# EasyEDA schematic SCH_Sensor Gantry PCB_2022-08-15.json
TITLE: Sheet_1; REV: 1.0; Date: 2022-06-12; Sheet: 1/1; Drawn By: Edward Niedziejko; Company: Your Company
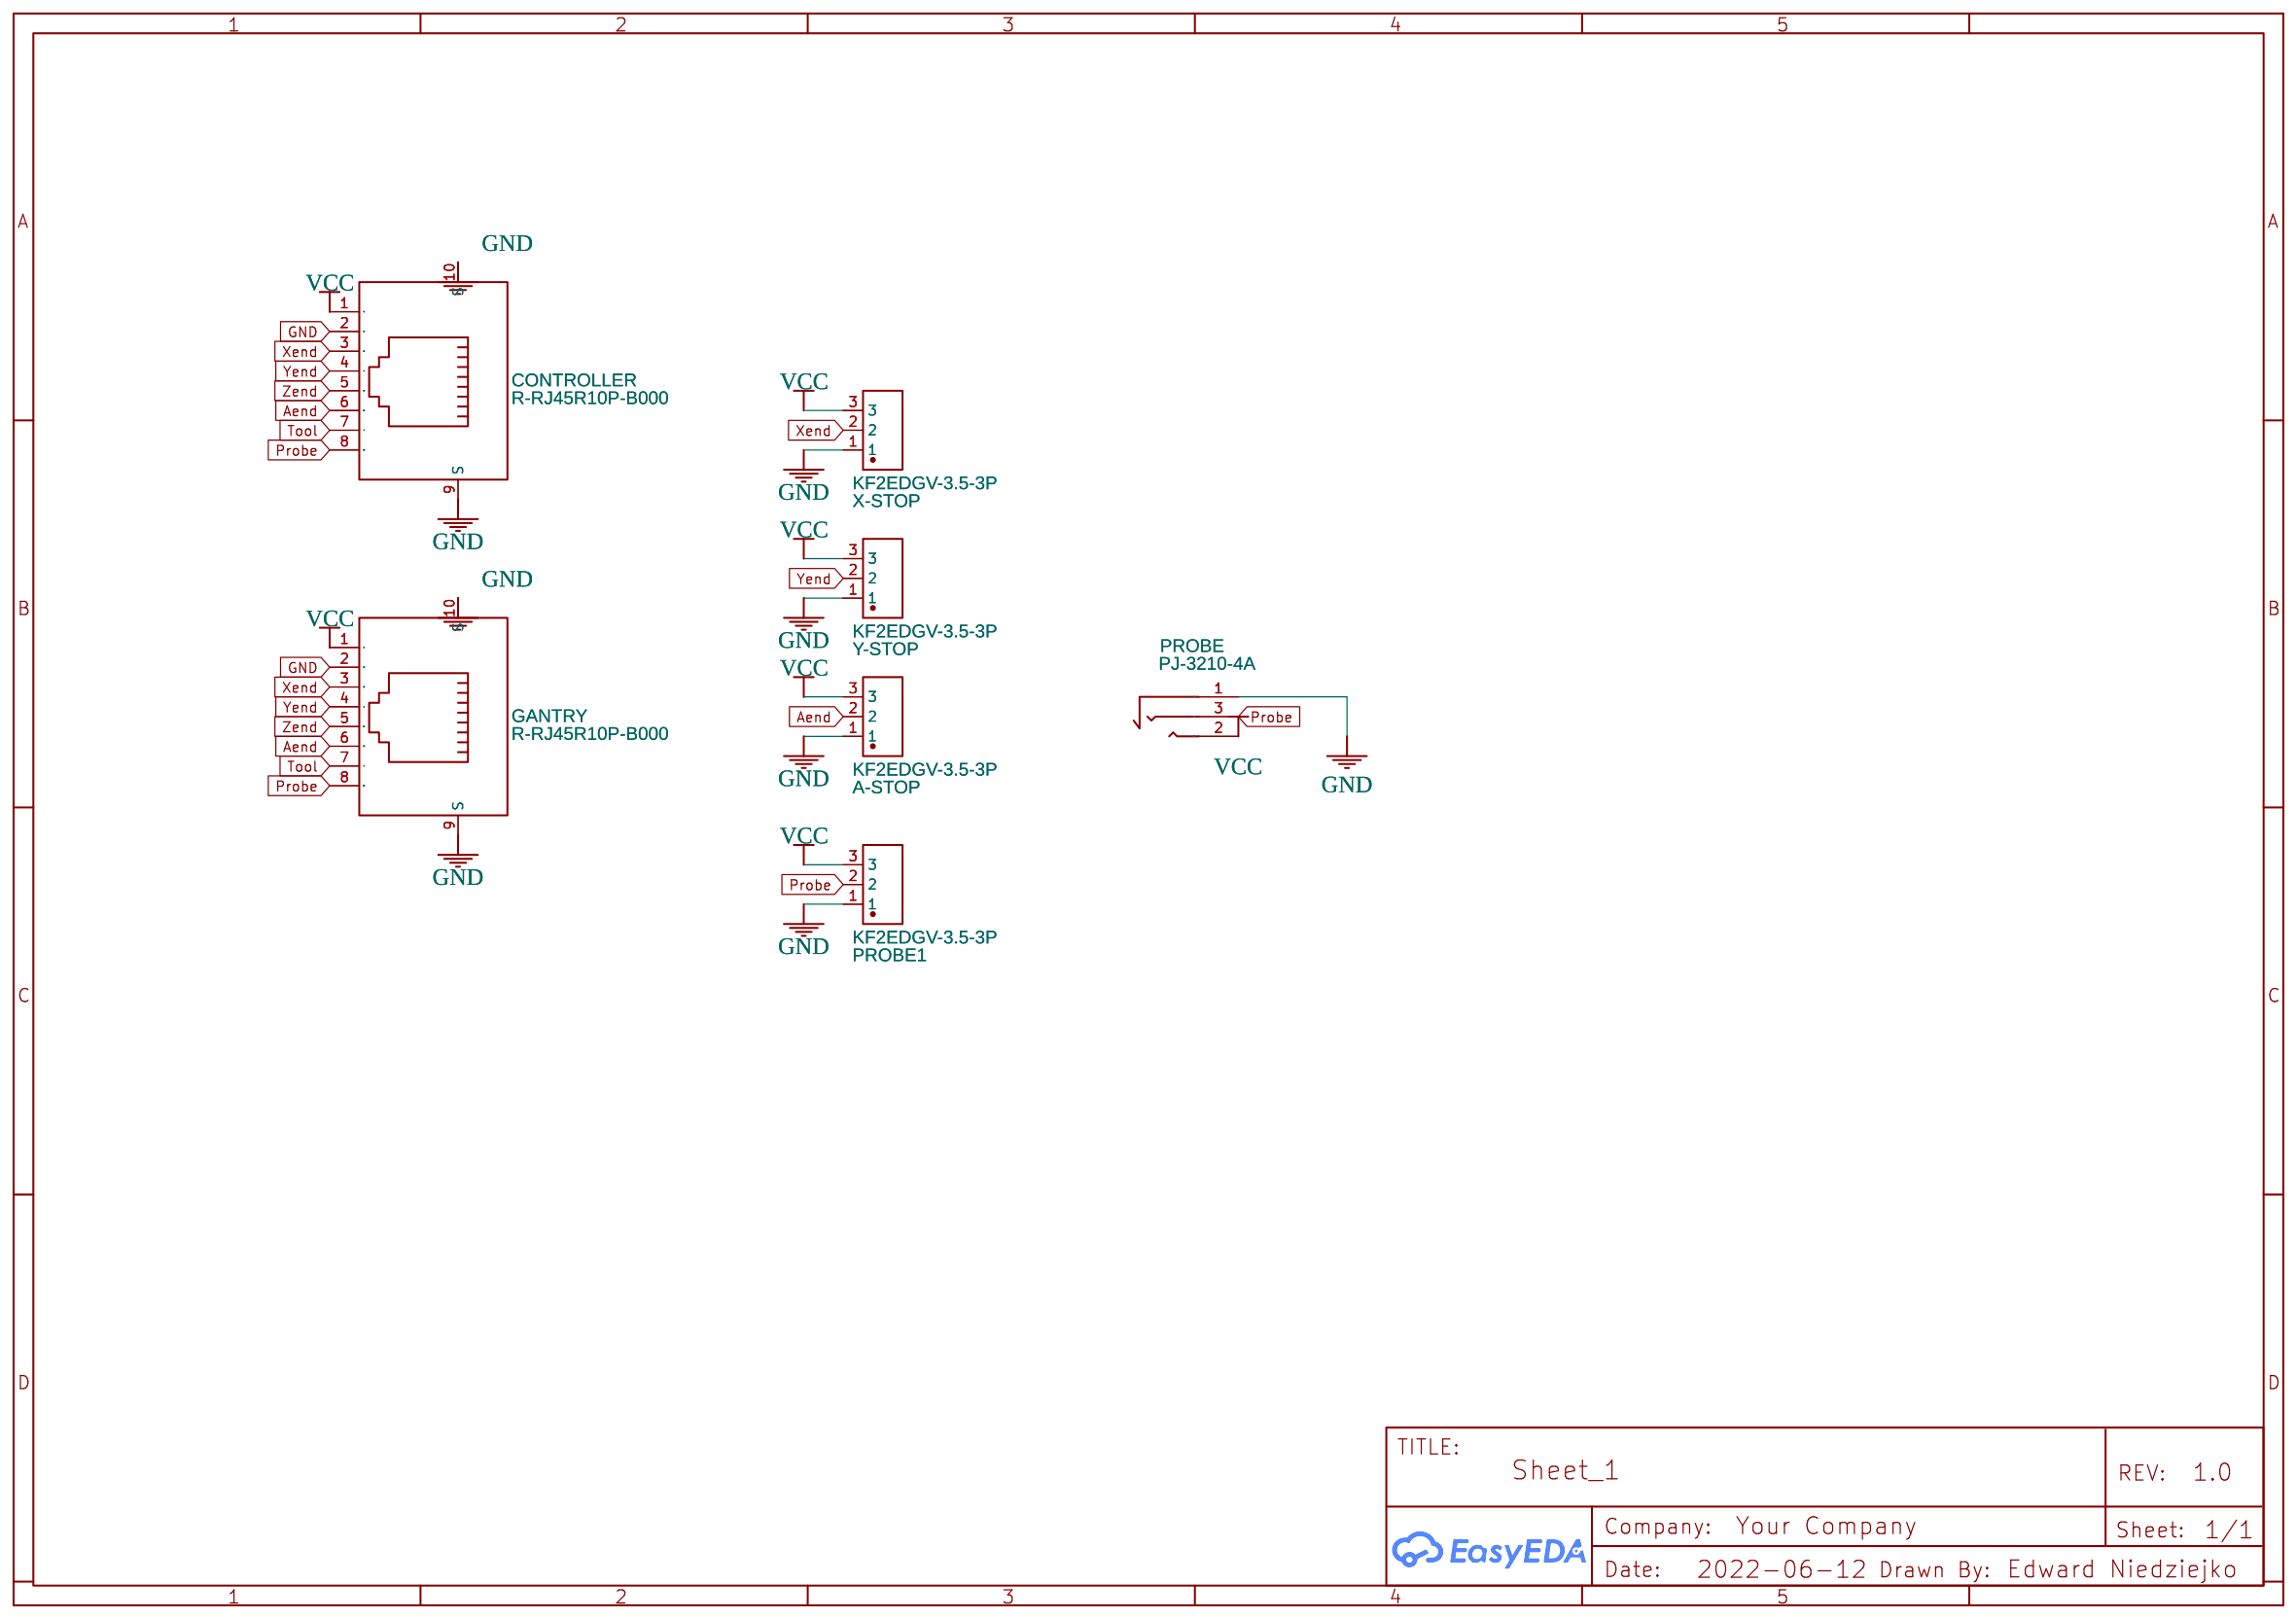
[diagram p0: schematic sheet]

## Parts
A-STOP  KF2EDGV-3.5-3P  [CONN-TH_3P-P3.50_KF2EDGV-3.5-3P]
CONTROLLER  R-RJ45R10P-B000  [RJ45-TH_R-RJ45R10P-B000]
GANTRY  R-RJ45R10P-B000  [RJ45-TH_R-RJ45R10P-B000]
PROBE  PJ-3210-4A  [AUDIO_TH_PJ-3210-4A]
PROBE1  KF2EDGV-3.5-3P  [CONN-TH_3P-P3.50_KF2EDGV-3.5-3P]
X-STOP  KF2EDGV-3.5-3P  [CONN-TH_3P-P3.50_KF2EDGV-3.5-3P]
Y-STOP  KF2EDGV-3.5-3P  [CONN-TH_3P-P3.50_KF2EDGV-3.5-3P]

## Library data of the parts
A-STOP PROBE1 X-STOP Y-STOP = KF2EDGV-3.5-3P: Supplier: LCSC; Supplier Part: C441322; Manufacturer: Cixi Kefa Elec; Contributor: LCSC; JLCPCB Part Class: Extended Part
CONTROLLER GANTRY = R-RJ45R10P-B000: Supplier: LCSC; Supplier Part: C386758; Manufacturer: Shenzhen Cankemeng; Contributor: LCSC; JLCPCB Part Class: Extended Part
PROBE = PJ-3210-4A: Supplier: LCSC; Manufacturer: HRO; Supplier Part: C136686; JLCPCB Part Class: Extended Part

## Nets
GND: A-STOP.1 CONTROLLER.2 CONTROLLER.9(S) CONTROLLER.10(S) GANTRY.2 GANTRY.9(S) GANTRY.10(S) PROBE.1 PROBE1.1 X-STOP.1 Y-STOP.1
VCC: A-STOP.3 CONTROLLER.1 GANTRY.1 PROBE.2 PROBE1.3 X-STOP.3 Y-STOP.3
Aend: A-STOP.2 CONTROLLER.6 GANTRY.6
Probe: CONTROLLER.8 GANTRY.8 PROBE.3 PROBE1.2
Tool: CONTROLLER.7 GANTRY.7
Xend: CONTROLLER.3 GANTRY.3 X-STOP.2
Yend: CONTROLLER.4 GANTRY.4 Y-STOP.2
Zend: CONTROLLER.5 GANTRY.5
